# EAGLE schematic pmod-level-conv-vqfn (EAGLE 7.7.0)
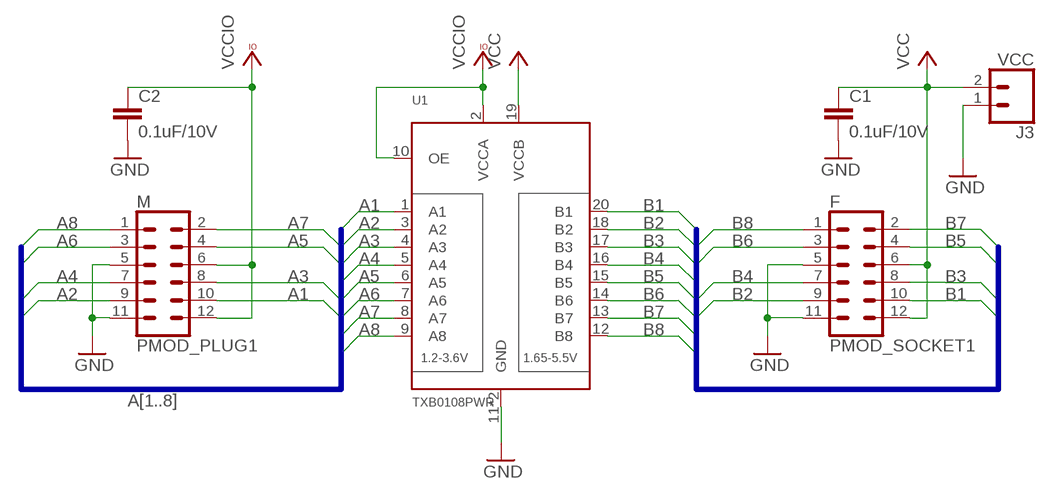
[diagram p0: schematic, sheet 1]

## Parts
C1  0.1uF/10V  C-EUC0603K  [C0603K]
C2  0.1uF/10V  C-EUC0603K  [C0603K]
F  PMOD_SOCKET1  CONN_06X2SMD_RA_SOCKET  [2X6_SMD_RA_SOCKET]
J3  VCC  CONN_02-JST-2MM-SMT  [JST-2-SMD]
M  PMOD_PLUG1  CONN_06X2SMD_RA_PLUG  [2X6_SMD_RA_PLUG]
U1  TXB0108PWR  TXB0108PWRVQFN20  [VQFN-20]

## Nets
A1: M.10 U1.1(A1)
A2: M.9 U1.3(A2)
A3: M.8 U1.4(A3)
A4: M.7 U1.5(A4)
A5: M.4 U1.6(A5)
A6: M.3 U1.7(A6)
A7: M.2 U1.8(A7)
A8: M.1 U1.9(A8)
B1: F.10 U1.20(B1)
B2: F.9 U1.18(B2)
B3: F.8 U1.17(B3)
B4: F.7 U1.16(B4)
B5: F.4 U1.15(B5)
B6: F.3 U1.14(B6)
B7: F.2 U1.13(B7)
B8: F.1 U1.12(B8)
GND: C1.2 C2.2 F.5 F.11 J3.1 M.5 M.11 U1.11(GND) U1.PAD(GND)
VCC: C1.1 F.6 F.12 J3.2 U1.19(VCCB)
VCCIO: C2.1 M.6 M.12 U1.2(VCCA) U1.10(OE)

## Buses
A[1..8]
B[1..8]

## Library data of the parts
C1 C2 = rcl:C-EU: CAPACITOR, European symbol; SPICEPREFIX: C
F M = mechanical:CONN_06X2: Multi connection point. Often used as Generic Header-pin footprint for 0.1 inch spaced/style header connections On any of the 0.1 inch spaced packages, you can populate with these: Break Away Headers - Straight <https://www.sparkfun.com/products/116> (PRT-00116) Break Away Male Headers - Right Angle <https://www.sparkfun.com/products/553> (PRT-00553) Female Headers <https://www.sparkfun.com/products/115> (PRT-00115) Break Away Headers - Machine Pin <https://www.sparkfun.com/products/117> (PRT-00117) Break Away Female Headers - Swiss Machine Pin <https://www.sparkfun.com/products/743> (PRT-00743)
J3 = SparkFun-Connectors:CONN_02: Multi connection point. Often used as Generic Header-pin footprint for 0.1 inch spaced/style header connections On any of the 0.1 inch spaced packages, you can populate with these: Break Away Headers - Straight <https://www.sparkfun.com/products/116> (PRT-00116) Break Away Male Headers - Right Angle <https://www.sparkfun.com/products/553> (PRT-00553) Female Headers <https://www.sparkfun.com/products/115> (PRT-00115) Break Away Headers - Machine Pin <https://www.sparkfun.com/products/117> (PRT-00117) Break Away Female Headers - Swiss Machine Pin <https://www.sparkfun.com/products/743> (PRT-00743) For SCREWTERMINALS and SPRING TERMINALS visit here: Screw Terimnals on SparkFun.com <https://www.sparkfun.com/search/results?term=Screw+Terminals> (5mm/3.5mm/2.54mm spacing) This device is also useful as a general connection point to wire up your design to another part of your project. Our various solder wires solder well into these plated through hole pads. Hook-Up Wire - Assortment (Stranded, 22 AWG) <https://www.sparkfun.com/products/11375> (PRT-11375) Hook-Up Wire - Assortment (Solid Core, 22 AWG) <https://www.sparkfun.com/products/11367> (PRT-11367) View the entire wire category on our website here <https://www.sparkfun.com/categories/141> Special notes: Molex polarized connector foot print use with: PRT-08233 with associated crimp pins and housings. 2.54_SCREWTERM for use with PRT-10571. 3.5mm Screw Terminal footprints for PRT-08084 5mm Screw Terminal footprints for use with PRT-08432; PROD_ID: CONN-11443
U1 = tom-semiconductors:TXB0108PWR: 8-Bit Bi-Directional Level Shifter 1.2V-3.6V (VCCA) to 1.65V-5.5V (VCCB) bi-directional level shifter with auto direction sensing. Max data rate - VCCA 1.8V: 20Mbps (50ns), VCCA 3.3V: 100Mbps (10ns) Digikey: 296-21527-1-ND